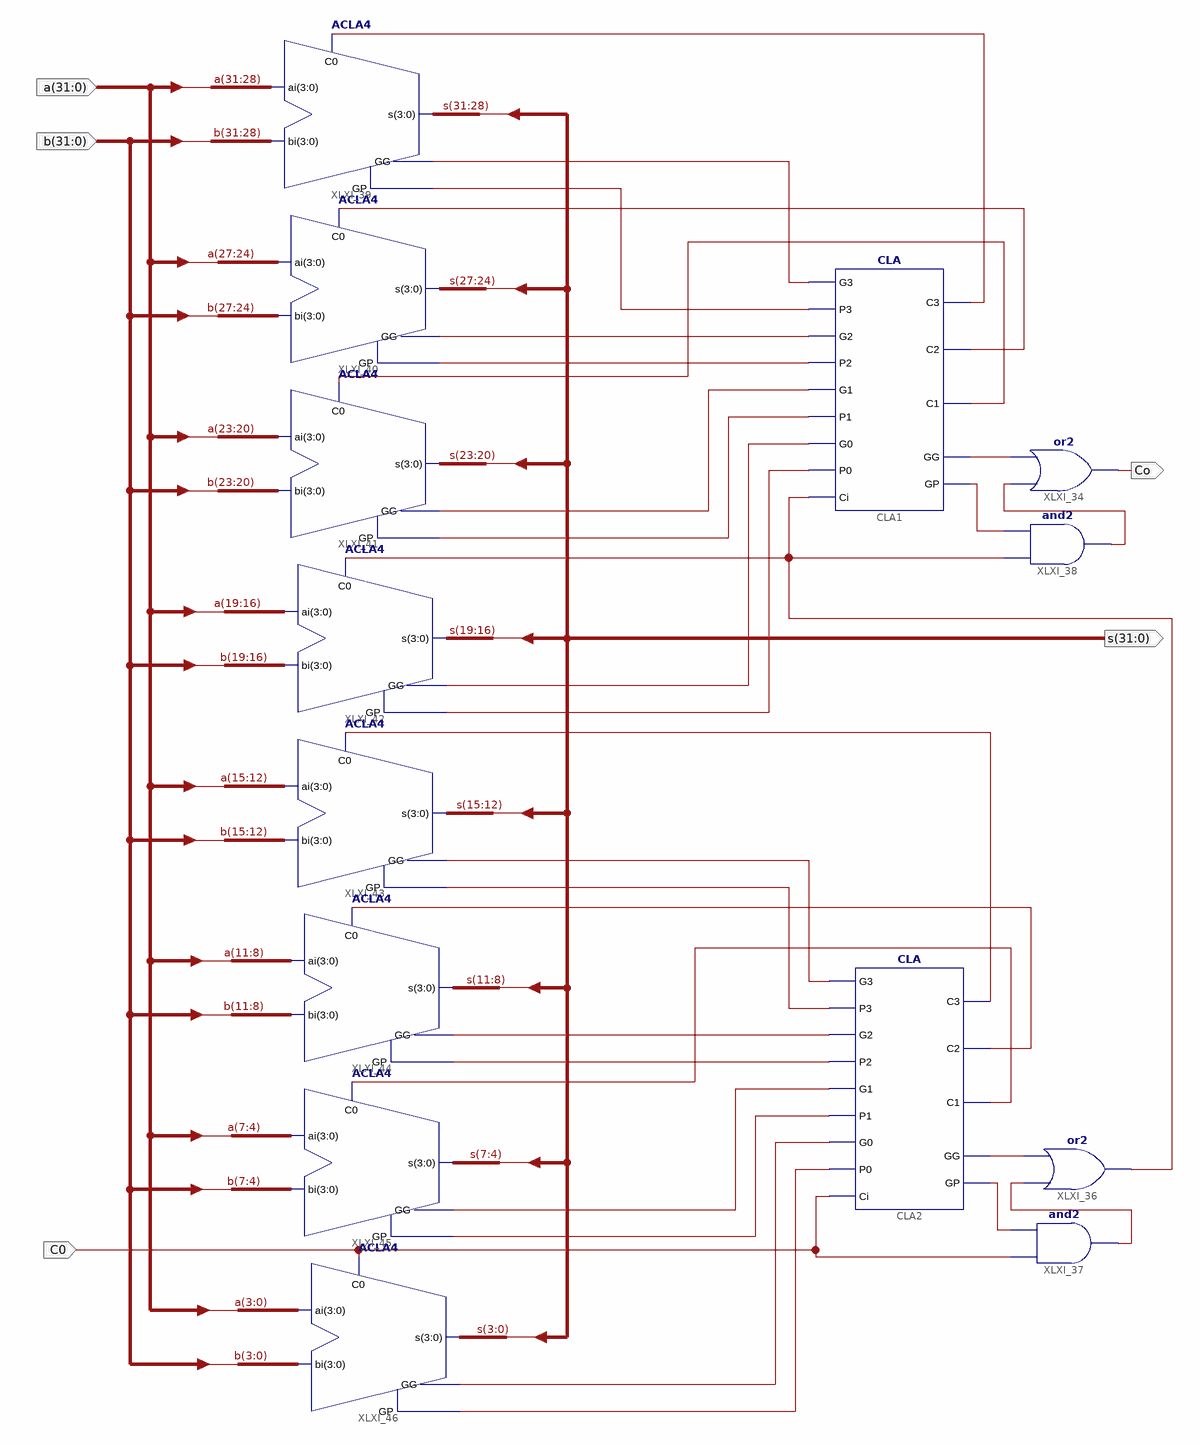
[diagram p0: schematic sheet 1]
// Xilinx ISE schematic ADC32.sch (kintex7) as structural Verilog: 14 symbols, 5 ports
module ADC32 (
  input  [31:0] a,
  input  [31:0] b,
  input  C0,
  output [31:0] s,
  output Co
);

  wire XLXN_190, XLXN_222, XLXN_255, XLXN_256, XLXN_308, XLXN_323, XLXN_324, XLXN_325, XLXN_326, XLXN_327,
       XLXN_328, XLXN_329, XLXN_344, XLXN_345, XLXN_348, XLXN_349, XLXN_358, XLXN_362, XLXN_363, XLXN_364,
       XLXN_365, XLXN_366, XLXN_367, XLXN_370, XLXN_371, XLXN_372, XLXN_377, XLXN_378, XLXN_379;

  CLA CLA1 (
    .G3(XLXN_190), .P3(XLXN_371), .G2(XLXN_365), .P0(XLXN_256), .Ci(XLXN_358), .G0(XLXN_255), .P2(XLXN_364),
    .G1(XLXN_363), .P1(XLXN_362), .C3(XLXN_370), .C2(XLXN_367), .C1(XLXN_366), .GP(XLXN_378), .GG(XLXN_308));
  CLA CLA2 (
    .G3(XLXN_329), .P3(XLXN_328), .G2(XLXN_327), .P0(XLXN_222), .Ci(C0), .G0(XLXN_323), .P2(XLXN_326),
    .G1(XLXN_325), .P1(XLXN_324), .C3(XLXN_348), .C2(XLXN_345), .C1(XLXN_344), .GP(XLXN_372), .GG(XLXN_349));
  or XLXI_34 (Co, XLXN_379, XLXN_308);
  or XLXI_36 (XLXN_358, XLXN_377, XLXN_349);
  and XLXI_37 (XLXN_377, C0, XLXN_372);
  and XLXI_38 (XLXN_379, XLXN_358, XLXN_378);
  ACLA4 XLXI_39 (.s(s[31:28]), .ai(a[31:28]), .bi(b[31:28]), .C0(XLXN_370), .GG(XLXN_190), .GP(XLXN_371));
  ACLA4 XLXI_40 (.s(s[27:24]), .ai(a[27:24]), .bi(b[27:24]), .C0(XLXN_367), .GG(XLXN_365), .GP(XLXN_364));
  ACLA4 XLXI_41 (.s(s[23:20]), .ai(a[23:20]), .bi(b[23:20]), .C0(XLXN_366), .GG(XLXN_363), .GP(XLXN_362));
  ACLA4 XLXI_42 (.s(s[19:16]), .ai(a[19:16]), .bi(b[19:16]), .C0(XLXN_358), .GG(XLXN_255), .GP(XLXN_256));
  ACLA4 XLXI_43 (.s(s[15:12]), .ai(a[15:12]), .bi(b[15:12]), .C0(XLXN_348), .GG(XLXN_329), .GP(XLXN_328));
  ACLA4 XLXI_44 (.s(s[11:8]), .ai(a[11:8]), .bi(b[11:8]), .C0(XLXN_345), .GG(XLXN_327), .GP(XLXN_326));
  ACLA4 XLXI_45 (.s(s[7:4]), .ai(a[7:4]), .bi(b[7:4]), .C0(XLXN_344), .GG(XLXN_325), .GP(XLXN_324));
  ACLA4 XLXI_46 (.s(s[3:0]), .ai(a[3:0]), .bi(b[3:0]), .C0(C0), .GG(XLXN_323), .GP(XLXN_222));
endmodule
